# EAGLE design XO345-1A (EAGLE 7.3.0)
Assembly variants: actual
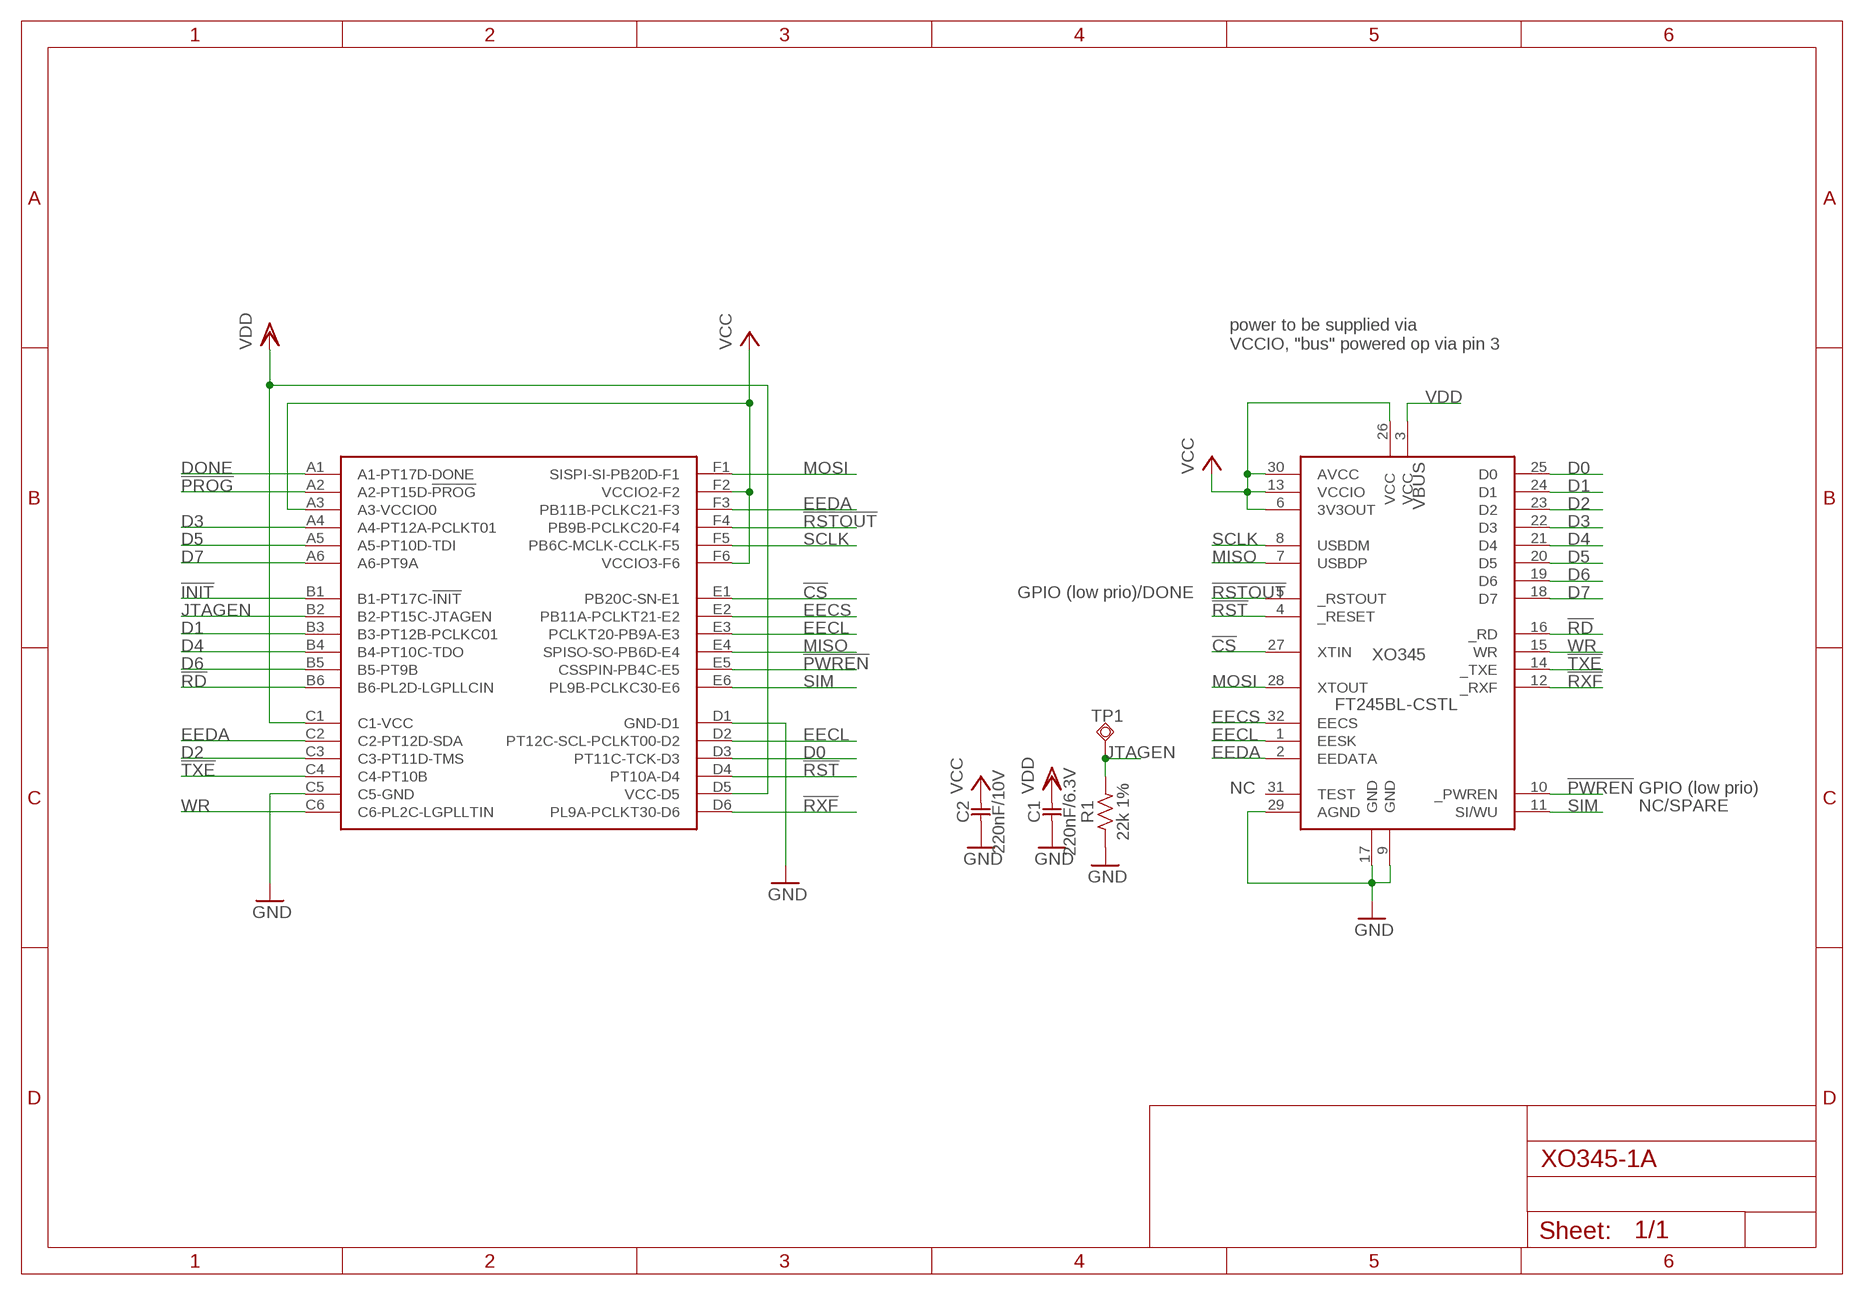
[diagram p0: schematic, sheet 1]

## Parts
C1  220nF/6.3V  CAP_0402  [C0402]
C2  220nF/10V  CAP_0603  [C0603]
IC  XO3-LCSP36  [WLCSP36]
R1  22k 1%  RES_0402  [R0402]
TP1  TPSQTP06R  [TP06R]  (not fitted in variant actual)
XO345  FT245BL-CSTL  [LQFP-32-CAST]  (not fitted in variant actual)

## Nets
!CS: IC.E1(PB20C-SN-E1) XO345.27(XTIN)
!INIT: IC.B1(B1-PT17C-!INIT!)
!PROG: IC.A2(A2-PT15D-!PROG!)
!PWREN: IC.E5(CSSPIN-PB4C-E5) XO345.10(_PWREN)
!RD: IC.B6(B6-PL2D-LGPLLCIN) XO345.16(_RD)
!RST: IC.D4(PT10A-D4) XO345.4(_RESET)
!RSTOUT: IC.F4(PB9B-PCLKC20-F4) XO345.5(_RSTOUT)
!RXF: IC.D6(PL9A-PCLKT30-D6) XO345.12(_RXF)
!TXE: IC.C4(C4-PT10B) XO345.14(_TXE)
D0: IC.D3(PT11C-TCK-D3) XO345.25(D0)
D1: IC.B3(B3-PT12B-PCLKC01) XO345.24(D1)
D2: IC.C3(C3-PT11D-TMS) XO345.23(D2)
D3: IC.A4(A4-PT12A-PCLKT01) XO345.22(D3)
D4: IC.B4(B4-PT10C-TDO) XO345.21(D4)
D5: IC.A5(A5-PT10D-TDI) XO345.20(D5)
D6: IC.B5(B5-PT9B) XO345.19(D6)
D7: IC.A6(A6-PT9A) XO345.18(D7)
DONE: IC.A1(A1-PT17D-DONE)
EECL: IC.D2(PT12C-SCL-PCLKT00-D2) IC.E3(PCLKT20-PB9A-E3) XO345.1(EESK)
EECS: IC.E2(PB11A-PCLKT21-E2) XO345.32(EECS)
EEDA: IC.C2(C2-PT12D-SDA) IC.F3(PB11B-PCLKC21-F3) XO345.2(EEDATA)
GND: C1.1 C2.1 IC.C5(C5-GND) IC.D1(GND-D1) R1.1 XO345.9(GND) XO345.17(GND) XO345.29(AGND)
JTAGEN: IC.B2(B2-PT15C-JTAGEN) R1.2 TP1.TP
MISO: IC.E4(SPISO-SO-PB6D-E4) XO345.7(USBDP)
MOSI: IC.F1(SISPI-SI-PB20D-F1) XO345.28(XTOUT)
SCLK: IC.F5(PB6C-MCLK-CCLK-F5) XO345.8(USBDM)
SIM: IC.E6(PL9B-PCLKC30-E6) XO345.11(SI/WU)
VCC: C2.2 IC.A3(A3-VCCIO0) IC.F2(VCCIO2-F2) IC.F6(VCCIO3-F6) XO345.6(3V3OUT) XO345.13(VCCIO) XO345.26(VCC) XO345.30(AVCC)
VDD: C1.2 IC.C1(C1-VCC) IC.D5(VCC-D5) XO345.3(VCC)
WR: IC.C6(C6-PL2C-LGPLLTIN) XO345.15(WR)
Unconnected: XO345.31(TEST)

## Notes on the sheet
- power to be supplied via 
  VCCIO, "bus" powered op via pin 3
- VBUS
- GPIO (low prio)/DONE
- NC | GPIO (low prio)
- NC/SPARE

## Library data of the parts
C1 = ESP8266:CAP_: Capacitor; MF: TDK; MFG_PARTNO: C1005X5R1A224M050BC; MOUSER: 810-C1005X5R1A224M; SIZE: 0402
C2 = ESP8266:CAP_: Capacitor; SIZE: 0603
IC = custom-parts:XO3-LCSP36: MachXO3-WLCSP36; MF: Lattice Semiconductor; MFG_PARTNO: LCMXO3L-1300E-5UWG36CTR50; MOUSER: 842-XO3L13E5U36CTR50
R1 = ESP8266:RES_: Resistor; MF: Vishay; MFG_PARTNO: CRCW04022K70FKED; MOUSER: 71-CRCW0402-2.7K-E3; SIZE: 0402
TP1 = testpad:TPSQ: Test pad
XO345 = custom-parts:FT245BL: USB FIFO 2nd Generation USB FIFO (USB <-> Parallel) Controller

## Board
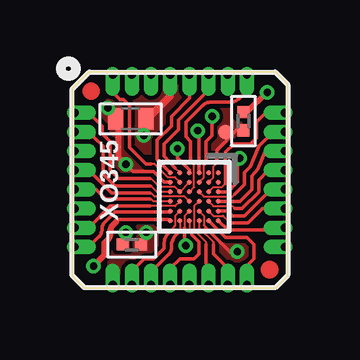
[diagram p1: board, top side]
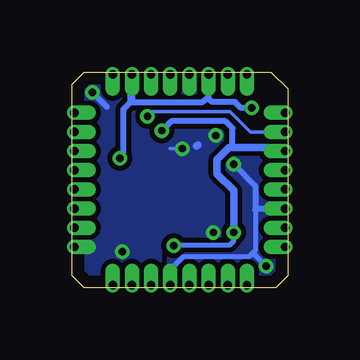
[diagram p2: board, bottom side, seen from below]

Size 9 x 9 mm. Coordinates in mm from the lower left corner, seen from the top.
Outline: 0,0.5 0.5,0 8.5,0 9,0.5 9,8.5 8.5,9 0.7,9 0,8.3 0,0.5
Copper layers (1*16): Top 0.02mm / dielectric 0.8mm / Bottom 0.02mm
Design rules "default *": minimum track width 3mil, minimum drill 0.3mm, track to track 0.06mm, track to pad 0.06mm, pad to pad 0.06mm, via to via 0.06mm, smd to smd 0mil, copper to edge 20mil, drill to drill 8mil, minimum pad ring 5mil, minimum via ring 6mil, stop-mask expansion 1mil, vias tented up to drill 0.4mm, thermal gap 10mil

### Footprints (pad centres in the part's own frame; a part is rotated, then mirrored left to right if it is on the bottom)
C0402 = smd 0.508 x 0.508: 1 -0.381,0; 2 0.381,0
C0603 = smd 0.635 x 0.889: 1 -0.635,0; 2 0.635,0
WLCSP36 = smd 0.2 x 0.2: A1 -1,1; A2 -0.6,1; A3 -0.2,1; A4 0.2,1; A5 0.6,1; A6 1,1; B1 -1,0.6; B2 -0.6,0.6; B3 -0.2,0.6; B4 0.2,0.6; B5 0.6,0.6; B6 1,0.6; C1 -1,0.2; C2 -0.6,0.2; C3 -0.2,0.2; C4 0.2,0.2; C5 0.6,0.2; C6 1,0.2; D1 -1,-0.2; D2 -0.6,-0.2; D3 -0.2,-0.2; D4 0.2,-0.2; D5 0.6,-0.2; D6 1,-0.2; E1 -1,-0.6; E2 -0.6,-0.6; E3 -0.2,-0.6; E4 0.2,-0.6; E5 0.6,-0.6; E6 1,-0.6; F1 -1,-1; F2 -0.6,-1; F3 -0.2,-1; F4 0.2,-1; F5 0.6,-1; F6 1,-1
R0402 = smd 0.508 x 0.508: 1 -0.381,0; 2 0.381,0
TP06R = smd 0.6 x 0.6: TP 0,0
LQFP-32-CAST = drill 0.35 pad 0.5 offset: 1 -4.4,2.8; 2 -4.4,2; 3 -4.4,1.2; 4 -4.4,0.4; 5 -4.4,-0.4; 6 -4.4,-1.2; 7 -4.4,-2; 8 -4.4,-2.8; 9 -2.8,-4.4; 10 -2,-4.4; 11 -1.2,-4.4; 12 -0.4,-4.4; 13 0.4,-4.4; 14 1.2,-4.4; 15 2,-4.4; 16 2.8,-4.4; 17 4.4,-2.8; 18 4.4,-2; 19 4.4,-1.2; 20 4.4,-0.4; 21 4.4,0.4; 22 4.4,1.2; 23 4.4,2; 24 4.4,2.8; 25 2.8,4.4; 26 2,4.4; 27 1.2,4.4; 28 0.4,4.4; 29 -0.4,4.4; 30 -1.2,4.4; 31 -2,4.4; 32 -2.8,4.4

### Placement (x,y rotation side)
C1  2.5,1.8 180 top
C2  2.45,7.04 180 top
IC  5.1,3.8 270 top
R1  7.15,6.95 270 top
TP1  6.4,6.5 0 top  (not fitted)
XO345  4.5,4.5 0 top  (not fitted)

### Tracks (layer width: path | path; a pad name or v marks a point on that pad's centre or on a via)
!CS
  Top 0.076: IC.E1 4.3,5
  Top 0.152: 4.3,5 3.85,5.5 3.85,6 4.45,6.6 4.45,6.99 5.7,8.25 XO345.27
!PWREN
  Top 0.076: IC.E5 4.3,3 4.3,2.6 4.1,2.35
  Top 0.152: 4.1,2.35 4,2.25 arc45 3.85,1.88 3.85,1.71 arc-45 3.81,1.61 3.4,1.2 3,1.2 2.5,0.7 XO345.10
!RD
  Top 0.152: IC.B6 6.4,2.1 7.3,2.1 7.6,1.8 7.6,1.2 7.3,0.9 XO345.16
!RST
  Top 0.076: IC.D4 4.7,3.8 3.45,3.8 3.3,3.95 3.25,3.95
  Top 0.152: 3.25,3.95 1.65,3.95 0.7,4.9 XO345.4
!RSTOUT
  Top 0.076: IC.F4 3.4,3.6 3.3,3.7 3.25,3.7
  Top 0.152: 3.25,3.7 1.4,3.7 1,4.1 XO345.5
!RXF
  Top 0.076: IC.D6 4.9,2.3 5,2.2
  Top 0.152: 5,2.2 5.3,1.9 5.3,1.4 5.1,1.2 4.5,1.2 4.1,0.8 XO345.12
!TXE
  Top 0.076: IC.C4 5.1,3.4 5.1,2.4 5.6,1.9 5.6,1.8
  Top 0.152: 5.6,1.8 5.6,1.1 XO345.14
D0
  Top 0.076: IC.D3 5.1,4.2 5.1,5.15 4.95,5.3
  Top 0.152: 4.95,5.3 4.95,6.1 4.75,6.3 4.75,6.9 5.44,7.59 arc-45 5.82,7.75 6.57,7.75 arc45 7.05,7.95 7.3,8.2 XO345.25
D1
  Top 0.076: IC.B3 5.9,4.2 6.25,4.2 6.4,4.35
  Top 0.152: 6.4,4.35 6.4,5.65 6.75,6 7.45,6 7.7,6.25 7.7,6.9 8.1,7.3 XO345.24
D2
  Top 0.076: IC.C3 5.5,3.8 6.7,3.8 6.8,3.9
  Top 0.152: 6.8,3.9 7.2,4.3 7.2,4.8 7.45,5.05 7.55,5.3 7.8,5.9 8.4,6.5 XO345.23
D3
  Top 0.152: IC.A4 7,3.6 7.5,4.1 7.5,4.65 7.75,4.95 8.05,5.65 8.25,5.7 XO345.22
D4
  Top 0.076: IC.B4 5.9,3.4 6.7,3.4 6.8,3.3
  Top 0.152: 6.8,3.3 7.1,3.3 7.8,4 7.8,4.5 8.2,4.9 XO345.21
D5
  Top 0.152: IC.A5 6.5,3.2 6.7,3 7.2,3 8.3,4.1 XO345.20
D6
  Top 0.076: IC.B5 5.9,3 6.3,3 6.5,2.8
  Top 0.152: 6.5,2.8 6.6,2.7 7.35,2.7 7.95,3.3 XO345.19
D7
  Top 0.152: IC.A6 6.5,2.4 8,2.4 8.1,2.5 XO345.18
EECL
  Top 0.076: 3.25,4.55 3.3,4.55 3.65,4.2 4.3,4.2 IC.E3 IC.D2
  Top 0.152: 3.25,4.55 1.95,4.55 1.6,4.9 1.6,6.1 1.25,6.44 1.25,6.74 0.7,7.3 XO345.1
EECS
  Top 0.076: IC.E2 4.3,4.6 4,4.6 3.45,5.15 3.3,5.15
  Top 0.152: 3.3,5.15 3.1,5.15 2.4,5.85 2.4,7.6 2.15,7.84 2,7.84 1.7,8.15 XO345.32
EEDA  (via drill 0.3)
  Top 0.076: IC.F3 3.55,4 3.3,4.25 3.25,4.25 | IC.C2 5.5,4.6 5.5,5.1 5.6,5.2
  Top 0.152: 3.25,4.25 1.8,4.25 1.3,4.75 1.3,5.9 0.9,6.29 0.9,6.5 XO345.2 | 5.6,5.2 5.6,6.1 5.85,6.35 v5.85,7.15
  Bottom 0.152: v5.85,7.15 5.65,7.35 2.4,7.35 1.55,6.5 XO345.2
GND  (via drill 0.3)
  Top 0.076: IC.C5 5.5,3 5.5,2.6 5.6,2.5
  Top 0.152: IC.D1 4.9,4.9 4.4,5.4 v4.4,5.8 | 5.6,2.5 6.6,1.5 v6.9,1.5 | R1.1 7.32,7.35
  Top 0.254: 7.32,7.35 v8.15,8.15 | C1.1 3.1,2.17 3.1,2.35
  Top 0.305: XO345.29 4.1,8 3,6.9 v3,6.35
  Bottom 0.152: v4.4,5.8 4.9,5.8
  Bottom 0.254: v8.15,8.15 7.55,7.55
  Bottom 0.305: 3.75,5.95 3.8,5.9
  other vias: 3.1,2.3
  pour Bottom (isolate 0.203, rank 4, no thermals): 0.7,9 0,8.3 0,0.5 0.5,0 8.5,0 9,0.5 9,8.5 8.5,9
  pour Top (isolate 0.152, no thermals): 2.8,2.65 1.5,1.35 1.5,0.05 1.9,0.05 1.9,0.5 2.65,1.25 3.4,1.25 3.6,1.45 3.6,2.4 3.35,2.65
  pour Top (isolate 0.152, no thermals): 4.4,9.15 2.5,9.15 2.5,5.6 3.35,5.6 4.65,7.05 4.65,8.9
  pour Top (isolate 0.152, no thermals): 7.8,1.99 5.8,1.99 5.8,1.09 7.8,1.09
JTAGEN
  Top 0.076: IC.B2 5.9,4.6 5.9,5.05 6.05,5.2
  Top 0.152: 6.05,5.2 6.05,5.75 6.87,6.57 R1.2
  pour Top (isolate 0.152, no thermals): 5.85,7.55 6.6,7.55 7.05,7.1 7.05,6.55 6.25,5.75 5.8,5.75 5.8,7.5
MISO
  Top 0.076: IC.E4 4.3,3.4 3.25,3.4
  Top 0.152: 3.25,3.4 1.6,3.4 0.7,2.5 XO345.7
MOSI
  Top 0.152: IC.F1 3.55,5.35 3.55,6.15 4.15,6.75 4.15,7.14 4.9,7.9 XO345.28
SCLK
  Top 0.152: IC.F5 4.1,3.15 1.8,3.15 1.34,2.69 arc45 1.25,2.47 1.25,2.44 arc-45 1.12,2.12 0.7,1.7 XO345.8
SIM
  Top 0.076: IC.E6 4.5,2.4 4.45,2.3
  Top 0.152: 4.45,2.3 4.32,2.17 arc45 4.15,1.76 4.15,1.69 arc-45 4.01,1.36 3.45,0.8 3.3,0.8
  Top 0.203: 3.3,0.8 XO345.11
VCC  (via drill 0.3)
  Top 0.152: IC.A3 6.5,4 6.9,4.4 6.9,5.3 v7,5.4 | IC.F2 3.85,4.4 3.4,4.85 2.55,4.85 v2.25,5.15 | IC.F6 4,2.85 1.95,2.85 1.85,2.75
  Top 0.254: v2.25,5.15 1.95,5.4 1.95,7.05 v1.5,7.5 | 1.85,2.75 1.7,2.6 arc45 1.6,2.35 1.6,2.29 arc-45 1.47,1.97 1.35,1.85 1.35,1.35 v0.9,0.9
  Bottom 0.203: 1.35,3.25 1.35,1.55 1.45,1.45 | 4.9,0.75 4.35,1.3 1.6,1.3 1.45,1.45 | 1.45,1.45 v0.9,0.9
  Bottom 0.254: XO345.13 4.9,0.75 | XO345.6 1.3,3.3 1.35,3.25 1.35,4.25 v2.25,5.15 | v7,5.4 7,5.5 6.85,5.65 6.85,7.45 6.55,7.75 6.55,8.85 XO345.26 6.5,7.75 3.55,7.75 3.3,7.95 | 3.3,7.95 XO345.30 | v1.5,7.5 1.95,7.5 2.2,7.75 3.15,7.75 3.3,7.9 3.3,7.95
  pour Top (isolate 0.15, no thermals): 1.7,7.89 1.5,7.89 1,7.39 1.6,6.79 1.6,4.99 2,4.59 3.1,4.59 3.1,5.09 2.3,5.89 2.3,7.29
  pour Bottom (isolate 0.2, no thermals): 0.4,5.79 0.4,0.79 0.8,0.39 5,0.39 5,1.59 2.4,1.59 1.9,2.09 1.9,3.89 2.8,4.79 2.8,5.39 2.4,5.79
VDD  (via drill 0.3)
  Top 0.076: IC.D5 4.7,3 4.7,2.5
  Top 0.152: 4.7,2.5 4.7,1.8 v4.75,1.75 | IC.C1 5.3,6.5 v5.25,6.55
  Top 0.305: C1.2 2.23,1.95 v2.25,2.3
  Bottom 0.203: v4.75,1.75 4.6,1.79 2.4,1.79 2.25,1.95 v2.25,2.3
  Bottom 0.254: XO345.3 0.7,5.7 0.85,5.85 | 2.3,5.85 2.3,6.65 2.6,6.95 4.85,6.95 v5.25,6.55
  Bottom 0.305: 0.85,5.85 2.3,5.85 2.45,5.85 2.95,5.35 2.95,4.75 2.25,4.05 v2.25,2.3
WR
  Top 0.076: IC.C6 5.3,2.5 5.9,1.9 5.9,1.8
  Top 0.152: 5.9,1.8 5.9,1.4 6.5,0.8 XO345.15
(copper drawn outside any net)
  shapes: Top circle x2

### Text on the board
Unrouted: MOSI | !CS | MISO | SCLK
tNames: XO345
Document: TCK | EECS | NC | VCC3.3 | GND | VCC3.3 | EECL | EEDA | TMS | !RST | VCORE1.2 | TDO | !RSTOUT | TDI | VCC3.3 | GND | GND | !PWREN | SIM | VCC3.3
Patch_Top: D0 | D1 | D2 | D3 | D4 | D5 | D6 | D7 | !RXF | !TXE | WR | !RD